# Altium schematic sheet 02-Block-Diagram.SchDoc: Block diagram.
size 420 x 297 mm; Author: Dmitry Shpakov; Organization: NoName; Revision: Revision; PageSize: A3; ProjectName: Project Name
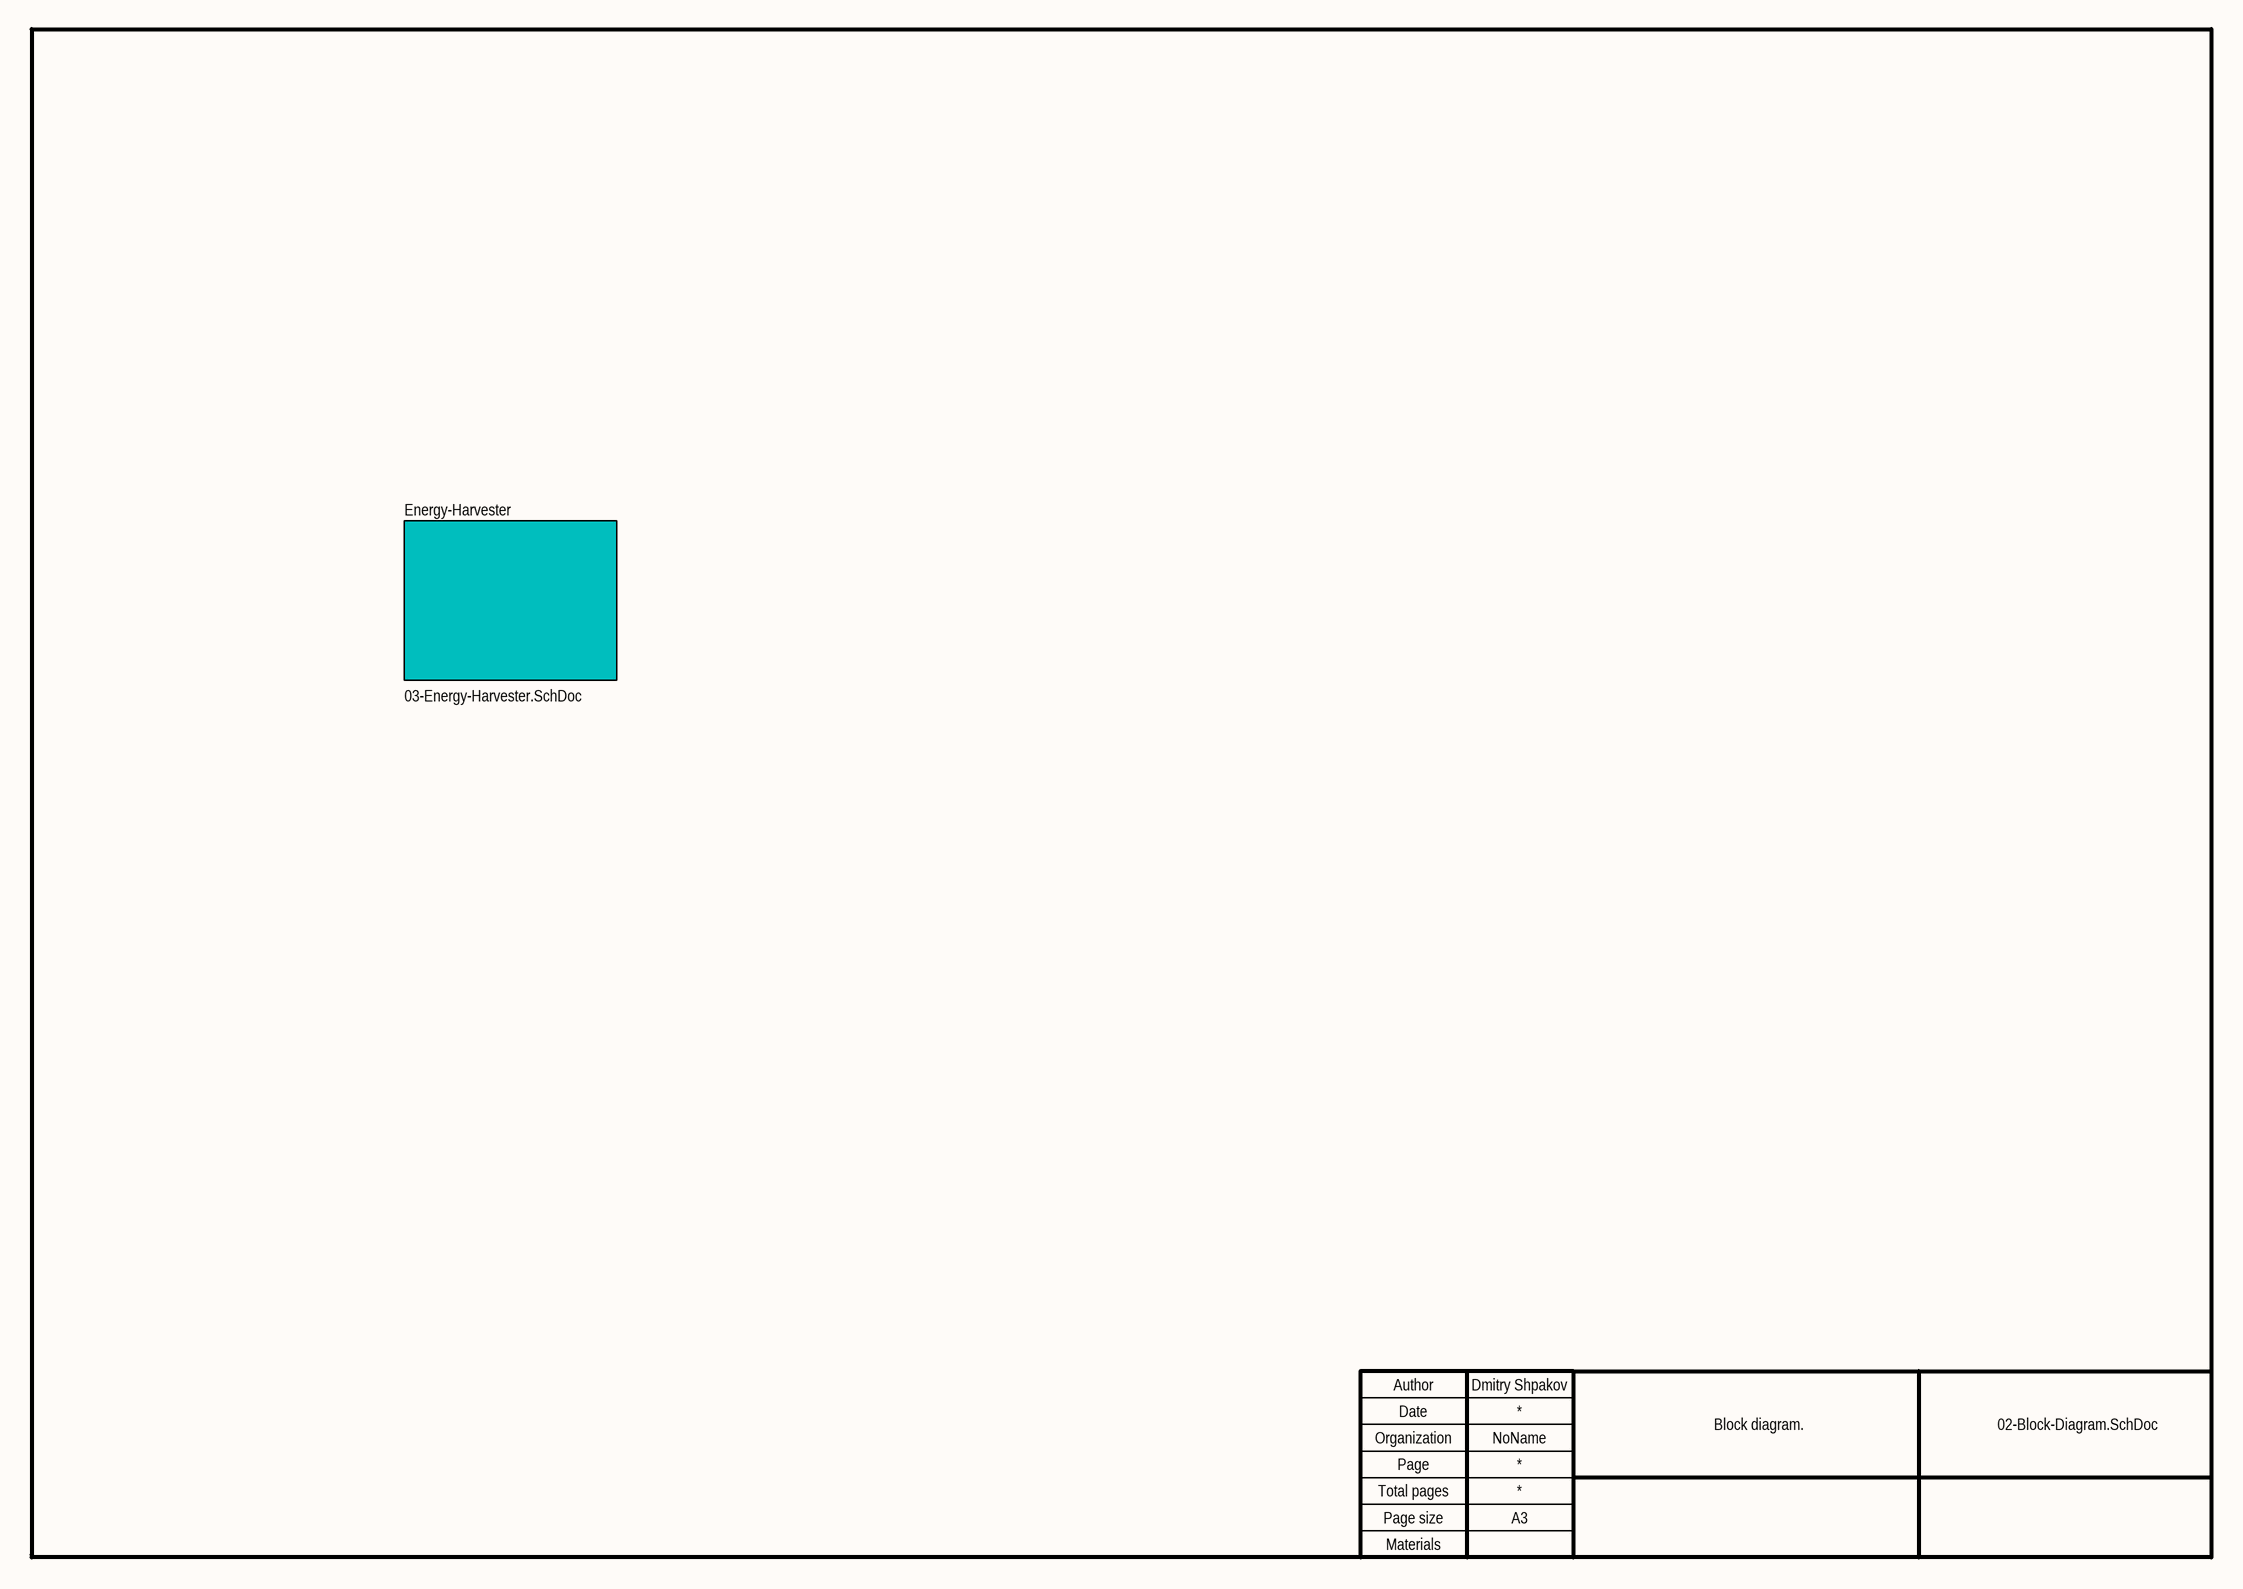
[diagram p0: 02-Block-Diagram.SchDoc]

## Sub-sheets
Energy-Harvester = 03-Energy-Harvester.SchDoc: no entries

## Notes on the sheet
- Author
- Date
- Organization
- Page
- Total pages
- Materials
- Page size